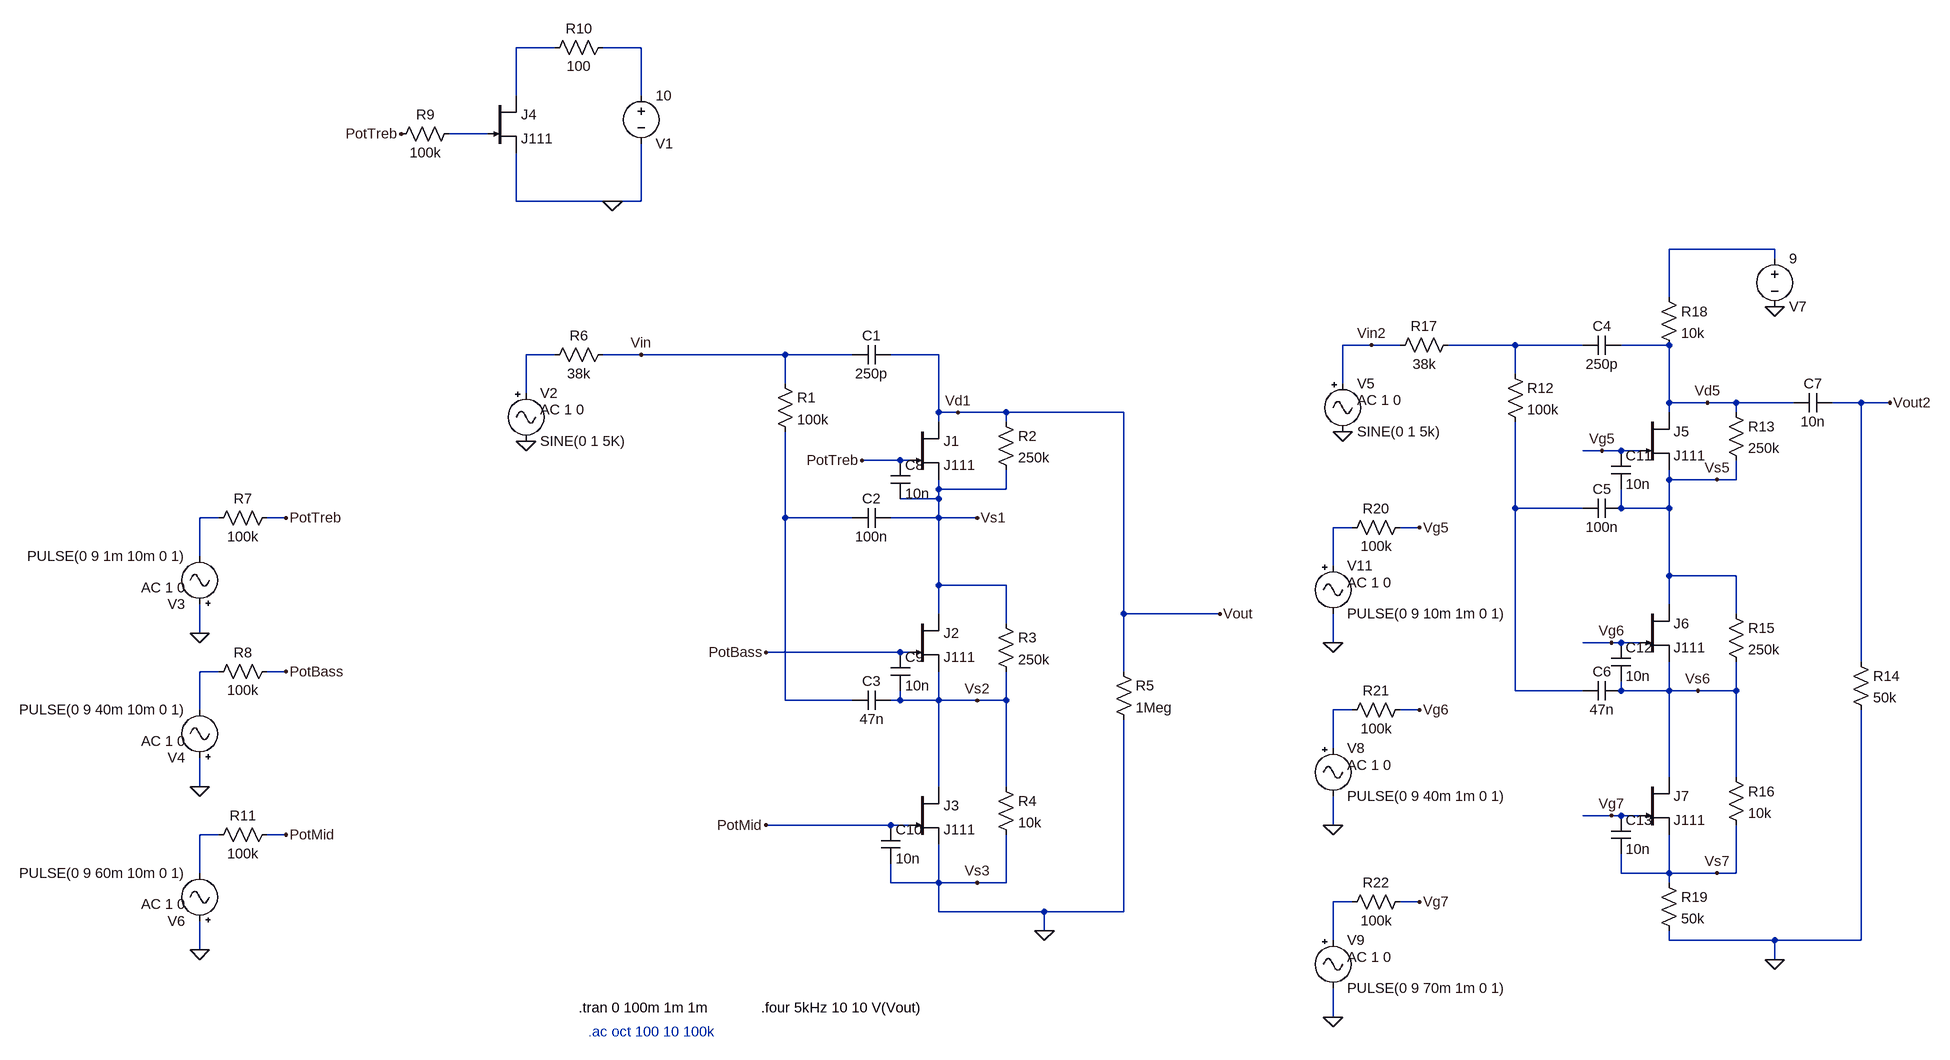
[diagram p0: schematic Jfet_based_tonestack.asc]
Jfet_based_tonestack.asc, the LTspice schematic file:
Version 4
SHEET 1 2360 1000
WIRE -304 -656 -368 -656
WIRE -160 -656 -224 -656
WIRE -368 -576 -368 -656
WIRE -160 -576 -160 -656
WIRE -416 -512 -480 -512
WIRE -368 -400 -368 -480
WIRE -208 -400 -368 -400
WIRE -160 -400 -160 -496
WIRE -160 -400 -208 -400
WIRE 1984 -320 1808 -320
WIRE 1984 -304 1984 -320
WIRE 1808 -240 1808 -320
WIRE 1312 -160 1264 -160
WIRE 1360 -160 1312 -160
WIRE 1552 -160 1440 -160
WIRE 1664 -160 1552 -160
WIRE 1808 -160 1728 -160
WIRE -304 -144 -352 -144
WIRE -160 -144 -224 -144
WIRE 80 -144 -160 -144
WIRE 192 -144 80 -144
WIRE 336 -144 256 -144
WIRE 1552 -112 1552 -160
WIRE 80 -96 80 -144
WIRE 1264 -96 1264 -160
WIRE -352 -80 -352 -144
WIRE 1808 -64 1808 -160
WIRE 1872 -64 1808 -64
WIRE 1920 -64 1872 -64
WIRE 2016 -64 1920 -64
WIRE 2128 -64 2080 -64
WIRE 2176 -64 2128 -64
WIRE 336 -48 336 -144
WIRE 368 -48 336 -48
WIRE 448 -48 368 -48
WIRE 656 -48 448 -48
WIRE 1808 -48 1808 -64
WIRE 1920 -48 1920 -64
WIRE 336 -32 336 -48
WIRE 448 -32 448 -48
WIRE 1696 16 1664 16
WIRE 1728 16 1696 16
WIRE 1760 16 1728 16
WIRE 272 32 208 32
WIRE 288 32 272 32
WIRE 1808 64 1808 48
WIRE 1888 64 1808 64
WIRE 1920 64 1920 32
WIRE 1920 64 1888 64
WIRE 336 80 336 64
WIRE 448 80 448 48
WIRE 448 80 336 80
WIRE 336 96 336 80
WIRE 336 96 272 96
WIRE 1552 112 1552 -32
WIRE 1664 112 1552 112
WIRE 1728 112 1728 80
WIRE 1808 112 1808 64
WIRE 1808 112 1728 112
WIRE -864 128 -896 128
WIRE -752 128 -784 128
WIRE 80 128 80 -16
WIRE 192 128 80 128
WIRE 336 128 336 96
WIRE 336 128 256 128
WIRE 400 128 336 128
WIRE 1280 144 1248 144
WIRE 1392 144 1360 144
WIRE -896 192 -896 128
WIRE 1248 208 1248 144
WIRE 1808 224 1808 112
WIRE 1920 224 1808 224
WIRE 336 240 336 128
WIRE 448 240 336 240
WIRE 1808 272 1808 224
WIRE 336 288 336 240
WIRE 656 288 656 -48
WIRE 816 288 656 288
WIRE 1920 288 1920 224
WIRE 448 304 448 240
WIRE -896 320 -896 272
WIRE 1248 336 1248 288
WIRE 1712 336 1664 336
WIRE 1728 336 1712 336
WIRE 1760 336 1728 336
WIRE 272 352 48 352
WIRE 288 352 272 352
WIRE 2128 368 2128 -64
WIRE -864 384 -896 384
WIRE -752 384 -784 384
WIRE 656 384 656 288
WIRE 1552 416 1552 112
WIRE 1664 416 1552 416
WIRE 1728 416 1728 400
WIRE 1808 416 1808 368
WIRE 1808 416 1728 416
WIRE 1856 416 1808 416
WIRE 1920 416 1920 368
WIRE 1920 416 1856 416
WIRE 80 432 80 128
WIRE 192 432 80 432
WIRE 272 432 272 416
WIRE 272 432 256 432
WIRE 336 432 336 384
WIRE 336 432 272 432
WIRE 400 432 336 432
WIRE 448 432 448 384
WIRE 448 432 400 432
WIRE -896 448 -896 384
WIRE 1280 448 1248 448
WIRE 1392 448 1360 448
WIRE 1248 512 1248 448
WIRE 1808 560 1808 416
WIRE 1920 560 1920 416
WIRE -896 576 -896 528
WIRE 336 576 336 432
WIRE 448 576 448 432
WIRE 1712 624 1664 624
WIRE 1728 624 1712 624
WIRE 1760 624 1728 624
WIRE 256 640 48 640
WIRE 288 640 256 640
WIRE 1248 640 1248 592
WIRE -864 656 -896 656
WIRE -752 656 -784 656
WIRE -896 720 -896 656
WIRE 1728 720 1728 688
WIRE 1808 720 1808 656
WIRE 1808 720 1728 720
WIRE 1888 720 1808 720
WIRE 1920 720 1920 640
WIRE 1920 720 1888 720
WIRE 256 736 256 704
WIRE 336 736 336 672
WIRE 336 736 256 736
WIRE 400 736 336 736
WIRE 448 736 448 656
WIRE 448 736 400 736
WIRE 1808 736 1808 720
WIRE 1280 768 1248 768
WIRE 1392 768 1360 768
WIRE 336 784 336 736
WIRE 512 784 336 784
WIRE 656 784 656 464
WIRE 656 784 512 784
WIRE 512 816 512 784
WIRE 1248 832 1248 768
WIRE 1808 832 1808 816
WIRE 1984 832 1808 832
WIRE 2128 832 2128 448
WIRE 2128 832 1984 832
WIRE -896 848 -896 800
WIRE 1984 864 1984 832
WIRE 1248 960 1248 912
FLAG 512 816 0
FLAG -352 0 0
FLAG 208 32 PotTreb
FLAG 48 352 PotBass
FLAG 48 640 PotMid
FLAG -896 320 0
FLAG -752 128 PotTreb
FLAG -896 576 0
FLAG -896 848 0
FLAG -752 384 PotBass
FLAG -752 656 PotMid
FLAG 816 288 Vout
FLAG -160 -144 Vin
FLAG -560 -512 PotTreb
FLAG -208 -400 0
FLAG 400 128 Vs1
FLAG 400 432 Vs2
FLAG 400 736 Vs3
FLAG 368 -48 Vd1
FLAG 1984 864 0
FLAG 1984 -224 0
FLAG 1888 64 Vs5
FLAG 1856 416 Vs6
FLAG 1888 720 Vs7
FLAG 1872 -64 Vd5
FLAG 1696 16 Vg5
FLAG 1712 336 Vg6
FLAG 1712 624 Vg7
FLAG 1264 -16 0
FLAG 2176 -64 Vout2
FLAG 1312 -160 Vin2
FLAG 1248 336 0
FLAG 1392 144 Vg5
FLAG 1248 640 0
FLAG 1392 448 Vg6
FLAG 1248 960 0
FLAG 1392 768 Vg7
SYMBOL njf 288 -32 R0
SYMATTR InstName J1
SYMATTR Value J111
SYMBOL cap 256 -160 R90
WINDOW 0 0 32 VBottom 2
WINDOW 3 32 32 VTop 2
SYMATTR InstName C1
SYMATTR Value 250p
SYMBOL res 64 -112 R0
SYMATTR InstName R1
SYMATTR Value 100k
SYMBOL cap 256 112 R90
WINDOW 0 0 32 VBottom 2
WINDOW 3 32 32 VTop 2
SYMATTR InstName C2
SYMATTR Value 100n
SYMBOL res 432 -48 R0
SYMATTR InstName R2
SYMATTR Value 250k
SYMBOL njf 288 288 R0
SYMATTR InstName J2
SYMATTR Value J111
SYMBOL njf 288 576 R0
SYMATTR InstName J3
SYMATTR Value J111
SYMBOL cap 256 416 R90
WINDOW 0 0 32 VBottom 2
WINDOW 3 32 32 VTop 2
SYMATTR InstName C3
SYMATTR Value 47n
SYMBOL res 640 368 R0
SYMATTR InstName R5
SYMATTR Value 1Meg
SYMBOL Misc\\signal -352 -96 R0
WINDOW 123 24 44 Left 2
WINDOW 39 0 0 Left 0
SYMATTR Value2 AC 1 0
SYMATTR InstName V2
SYMATTR Value SINE(0 1 5K)
SYMBOL voltage -160 -592 R0
WINDOW 0 24 96 Left 2
WINDOW 3 24 16 Left 2
WINDOW 123 0 0 Left 0
WINDOW 39 0 0 Left 0
SYMATTR InstName V1
SYMATTR Value 10
SYMBOL njf -416 -576 R0
SYMATTR InstName J4
SYMATTR Value J111
SYMBOL res -464 -528 R90
WINDOW 0 0 56 VBottom 2
WINDOW 3 32 56 VTop 2
SYMATTR InstName R9
SYMATTR Value 100k
SYMBOL res -208 -672 R90
WINDOW 0 0 56 VBottom 2
WINDOW 3 32 56 VTop 2
SYMATTR InstName R10
SYMATTR Value 100
SYMBOL res 432 288 R0
SYMATTR InstName R3
SYMATTR Value 250k
SYMBOL res 432 560 R0
SYMATTR InstName R4
SYMATTR Value 10k
SYMBOL res -768 112 R90
WINDOW 0 0 56 VBottom 2
WINDOW 3 32 56 VTop 2
SYMATTR InstName R7
SYMATTR Value 100k
SYMBOL res -768 368 R90
WINDOW 0 0 56 VBottom 2
WINDOW 3 32 56 VTop 2
SYMATTR InstName R8
SYMATTR Value 100k
SYMBOL res -768 640 R90
WINDOW 0 0 56 VBottom 2
WINDOW 3 32 56 VTop 2
SYMATTR InstName R11
SYMATTR Value 100k
SYMBOL res -208 -160 R90
WINDOW 0 0 56 VBottom 2
WINDOW 3 32 56 VTop 2
SYMATTR InstName R6
SYMATTR Value 38k
SYMBOL njf 1760 -48 R0
SYMATTR InstName J5
SYMATTR Value J111
SYMBOL cap 1728 -176 R90
WINDOW 0 0 32 VBottom 2
WINDOW 3 32 32 VTop 2
SYMATTR InstName C4
SYMATTR Value 250p
SYMBOL res 1536 -128 R0
SYMATTR InstName R12
SYMATTR Value 100k
SYMBOL cap 1728 96 R90
WINDOW 0 0 32 VBottom 2
WINDOW 3 32 32 VTop 2
SYMATTR InstName C5
SYMATTR Value 100n
SYMBOL res 1904 -64 R0
SYMATTR InstName R13
SYMATTR Value 250k
SYMBOL njf 1760 272 R0
SYMATTR InstName J6
SYMATTR Value J111
SYMBOL njf 1760 560 R0
SYMATTR InstName J7
SYMATTR Value J111
SYMBOL cap 1728 400 R90
WINDOW 0 0 32 VBottom 2
WINDOW 3 32 32 VTop 2
SYMATTR InstName C6
SYMATTR Value 47n
SYMBOL res 2112 352 R0
SYMATTR InstName R14
SYMATTR Value 50k
SYMBOL res 1904 272 R0
SYMATTR InstName R15
SYMATTR Value 250k
SYMBOL res 1904 544 R0
SYMATTR InstName R16
SYMATTR Value 10k
SYMBOL res 1792 -256 R0
SYMATTR InstName R18
SYMATTR Value 10k
SYMBOL res 1792 720 R0
SYMATTR InstName R19
SYMATTR Value 50k
SYMBOL voltage 1984 -320 R0
WINDOW 0 24 96 Left 2
WINDOW 3 24 16 Left 2
WINDOW 123 0 0 Left 0
WINDOW 39 0 0 Left 0
SYMATTR InstName V7
SYMATTR Value 9
SYMBOL cap 2080 -80 R90
WINDOW 0 0 32 VBottom 2
WINDOW 3 32 32 VTop 2
SYMATTR InstName C7
SYMATTR Value 10n
SYMBOL Misc\\signal 1264 -112 R0
WINDOW 123 24 44 Left 2
WINDOW 39 0 0 Left 0
SYMATTR Value2 AC 1 0
SYMATTR InstName V5
SYMATTR Value SINE(0 1 5k)
SYMBOL res 1456 -176 R90
WINDOW 0 0 56 VBottom 2
WINDOW 3 32 56 VTop 2
SYMATTR InstName R17
SYMATTR Value 38k
SYMBOL res 1376 128 R90
WINDOW 0 0 56 VBottom 2
WINDOW 3 32 56 VTop 2
SYMATTR InstName R20
SYMATTR Value 100k
SYMBOL res 1376 432 R90
WINDOW 0 0 56 VBottom 2
WINDOW 3 32 56 VTop 2
SYMATTR InstName R21
SYMATTR Value 100k
SYMBOL res 1376 752 R90
WINDOW 0 0 56 VBottom 2
WINDOW 3 32 56 VTop 2
SYMATTR InstName R22
SYMATTR Value 100k
SYMBOL Misc\\signal 1248 192 R0
WINDOW 123 24 44 Left 2
WINDOW 39 0 0 Left 0
SYMATTR Value2 AC 1 0
SYMATTR InstName V11
SYMATTR Value PULSE(0 9 10m 1m 0 1)
SYMBOL Misc\\signal 1248 496 R0
WINDOW 123 24 44 Left 2
WINDOW 39 0 0 Left 0
SYMATTR Value2 AC 1 0
SYMATTR InstName V8
SYMATTR Value PULSE(0 9 40m 1m 0 1)
SYMBOL Misc\\signal 1248 816 R0
WINDOW 123 24 44 Left 2
WINDOW 39 0 0 Left 0
SYMATTR Value2 AC 1 0
SYMATTR InstName V9
SYMATTR Value PULSE(0 9 70m 1m 0 1)
SYMBOL Misc\\signal -896 288 R180
WINDOW 123 24 44 Left 2
WINDOW 39 0 0 Left 0
SYMATTR Value2 AC 1 0
SYMATTR InstName V3
SYMATTR Value PULSE(0 9 1m 10m 0 1)
SYMBOL Misc\\signal -896 544 R180
WINDOW 123 24 44 Left 2
WINDOW 39 0 0 Left 0
SYMATTR Value2 AC 1 0
SYMATTR InstName V4
SYMATTR Value PULSE(0 9 40m 10m 0 1)
SYMBOL Misc\\signal -896 816 R180
WINDOW 123 24 44 Left 2
WINDOW 39 0 0 Left 0
SYMATTR Value2 AC 1 0
SYMATTR InstName V6
SYMATTR Value PULSE(0 9 60m 10m 0 1)
SYMBOL cap 256 32 R0
SYMATTR InstName C8
SYMATTR Value 10n
SYMBOL cap 256 352 R0
SYMATTR InstName C9
SYMATTR Value 10n
SYMBOL cap 240 640 R0
SYMATTR InstName C10
SYMATTR Value 10n
SYMBOL cap 1712 16 R0
SYMATTR InstName C11
SYMATTR Value 10n
SYMBOL cap 1712 336 R0
SYMATTR InstName C12
SYMATTR Value 10n
SYMBOL cap 1712 624 R0
SYMATTR InstName C13
SYMATTR Value 10n
TEXT -264 944 Left 2 !.tran 0 100m 1m 1m
TEXT -248 984 Left 2 ;.ac oct 100 10 100k
TEXT 40 944 Left 2 !.four 5kHz 10 10 V(Vout)

The netlist it stands for:
* Jfet_based_tonestack.asc
J1 Vd1 PotTreb Vs1 J111
C1 Vd1 Vin 250p
R1 Vin N009 100k
C2 Vs1 N009 100n
R2 Vd1 Vs1 250k
J2 Vs1 PotBass Vs2 J111
J3 Vs2 PotMid 0 J111
C3 Vs2 N009 47n
R5 Vd1 0 1Meg
V2 N006 0 SINE(0 1 5K) AC 1 0
V1 N002 0 10
J4 N001 N003 0 J111
R9 N003 PotTreb 100k
R10 N002 N001 100
R3 Vs1 Vs2 250k
R4 Vs2 0 10k
R7 PotTreb N008 100k
R8 PotBass N011 100k
R11 PotMid N013 100k
R6 Vin N006 38k
J5 Vd5 Vg5 Vs5 J111
C4 Vd5 N005 250p
R12 N005 N007 100k
C5 Vs5 N007 100n
R13 Vd5 Vs5 250k
J6 Vs5 Vg6 Vs6 J111
J7 Vs6 Vg7 Vs7 J111
C6 Vs6 N007 47n
R14 Vout2 0 50k
R15 Vs5 Vs6 250k
R16 Vs6 Vs7 10k
R18 N004 Vd5 10k
R19 Vs7 0 50k
V7 N004 0 9
C7 Vout2 Vd5 10n
V5 Vin2 0 SINE(0 1 5k) AC 1 0
R17 N005 Vin2 38k
R20 Vg5 N010 100k
R21 Vg6 N012 100k
R22 Vg7 N014 100k
V11 N010 0 PULSE(0 9 10m 1m 0 1) AC 1 0
V8 N012 0 PULSE(0 9 40m 1m 0 1) AC 1 0
V9 N014 0 PULSE(0 9 70m 1m 0 1) AC 1 0
V3 0 N008 PULSE(0 9 1m 10m 0 1) AC 1 0
V4 0 N011 PULSE(0 9 40m 10m 0 1) AC 1 0
V6 0 N013 PULSE(0 9 60m 10m 0 1) AC 1 0
C8 PotTreb Vs1 10n
C9 PotBass Vs2 10n
C10 PotMid 0 10n
C11 Vg5 Vs5 10n
C12 Vg6 Vs6 10n
C13 Vg7 Vs7 10n
.model NJF NJF
.model PJF PJF
.lib standard.jft
.tran 0 100m 1m 1m
* .ac oct 100 10 100k
.four 5kHz 10 10 V(Vout)
.backanno
.end